# EAGLE design LightSwitch3 (EAGLE 8.7.0)
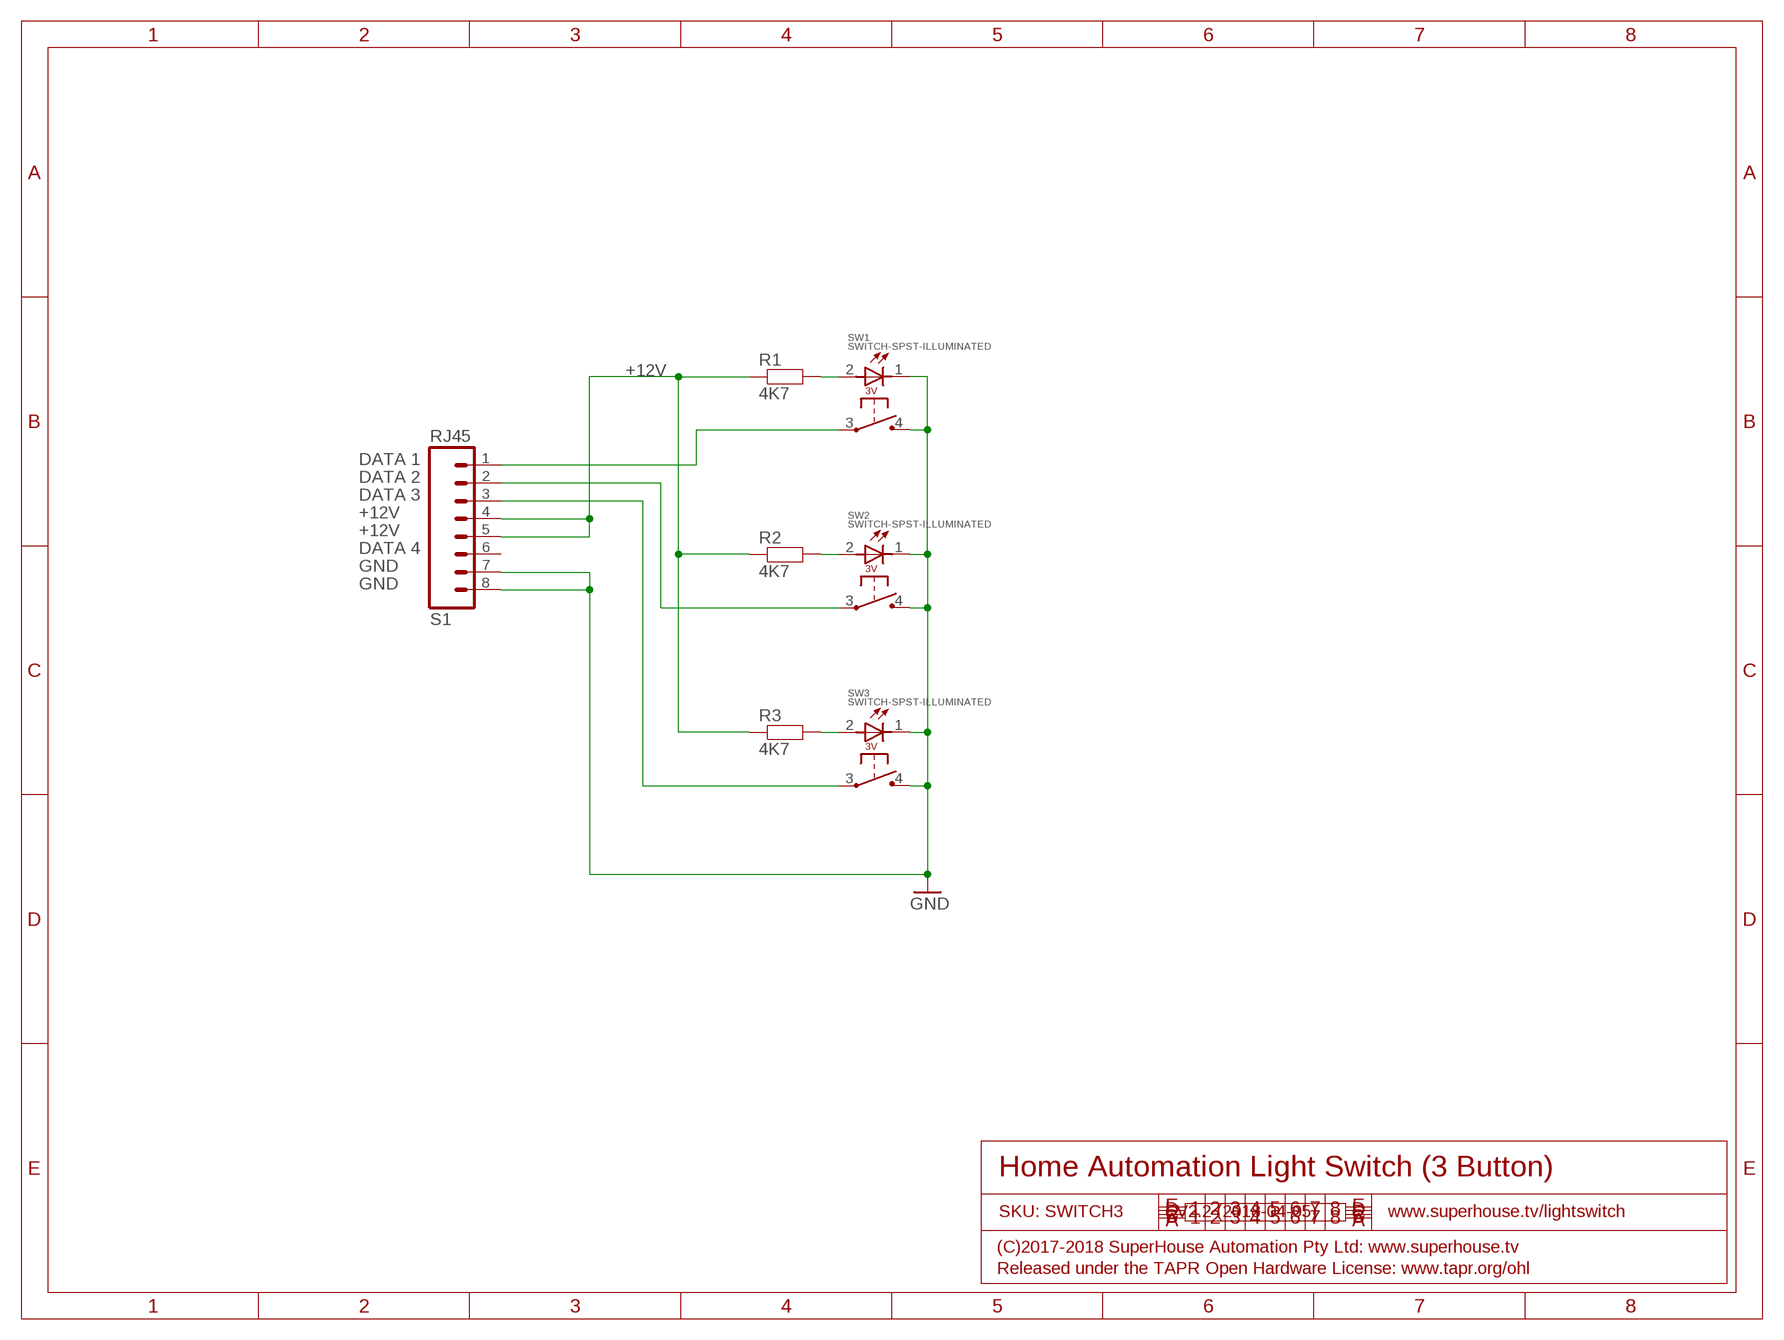
[diagram p0: schematic, sheet 1]

## Parts
R1  4K7  RESISTOR0603  [0603]
R2  4K7  RESISTOR0603  [0603]
R3  4K7  RESISTOR0603  [0603]
S1  RJ45  [RJ45]
SW1  SWITCH-SPST-ILLUMINATED  [SWITCH-SPST-ILLUMINATED]
SW2  SWITCH-SPST-ILLUMINATED  [SWITCH-SPST-ILLUMINATED]
SW3  SWITCH-SPST-ILLUMINATED  [SWITCH-SPST-ILLUMINATED]

## Nets
+12V: R1.1 R2.1 R3.1 S1.4 S1.5
GND: S1.7 S1.8 SW1.1(-) SW1.4(NO) SW2.1(-) SW2.4(NO) SW3.1(-) SW3.4(NO)
N$1: R1.2 SW1.2(+)
N$2: S1.3 SW3.3(COM)
N$3: R2.2 SW2.2(+)
N$4: S1.1 SW1.3(COM)
N$5: S1.2 SW2.3(COM)
N$6: R3.2 SW3.2(+)
Unconnected: S1.6

## Notes on the sheet
- DATA 1
- DATA 2
- DATA 3
- +12V
- +12V
- DATA 4
- GND
- GND
- Home Automation Light Switch (3 Button)
- SKU: SWITCH3 | V2.2 (2018-04-05) | www.superhouse.tv/lightswitch
- (C)2017-2018 SuperHouse Automation Pty Ltd: www.superhouse.tv
- Released under the TAPR Open Hardware License: www.tapr.org/ohl

## Library data of the parts
R1-R3 = freetronics-jon:RESISTOR: Resistor Basic schematic elements and footprints for 0603, 1206, and PTH 1/10th watt (small) resistors.
S1 = freetronics-jon:RJ45
SW1-SW3 = freetronics-jon:SWITCH-SPST-ILLUMINATED

## Net classes
0 Default: width 0.203 mm
1 VCC: width 0.305 mm

## Board
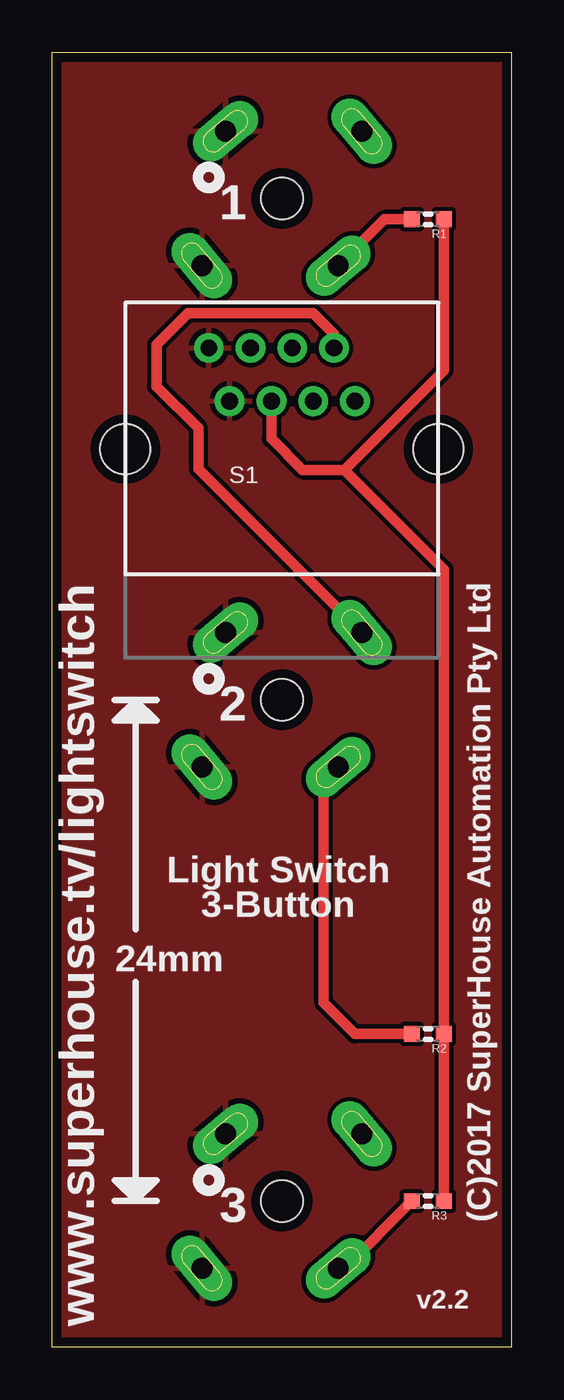
[diagram p1: board, top side]
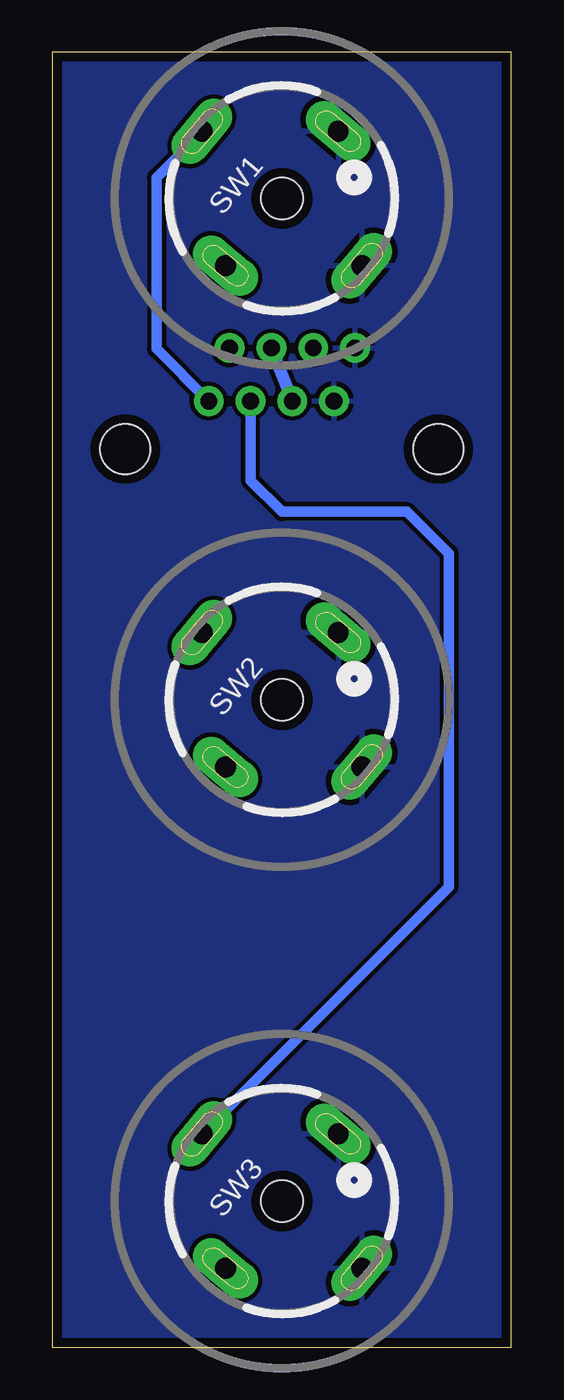
[diagram p2: board, bottom side, seen from below]

Size 22 x 62 mm. Coordinates in mm from the lower left corner, seen from the top.
Outline: 22,0 0,0 0,62 22,62 22,0
Copper layers (1*16): Top 0.035mm / dielectric 1.5mm / Bottom 0.035mm
Design rules "SuperHouse-Design-Rules": minimum track width 10mil, minimum drill 24mil, track to track 8mil, track to pad 8mil, pad to pad 8mil, via to via 8mil, smd to smd 6mil, copper to edge 18mil, drill to drill 8mil, minimum pad ring 7mil, minimum via ring 8mil, stop-mask expansion 4mil, vias tented up to drill 0.5mm, thermal gap 10mil
Holes 2 mm at 11,7 11,31 11,55

### Footprints (pad centres in the part's own frame; a part is rotated, then mirrored left to right if it is on the bottom)
0603 = smd 0.762 x 0.762: 1 -0.762,0; 2 0.762,0
RJ45 = drill 0.8 pad 1.422: 1 3.5,2.3; 2 2.5,4.84; 3 1.5,2.3; 4 0.5,4.84; 5 -0.5,2.3; 6 -1.5,4.84; 7 -2.5,2.3; 8 -3.5,4.84 | hole 2.4: -7.5,0; 7.5,0
SWITCH-SPST-ILLUMINATED = drill 1 pad 1.778 long: 1 4.2,0; 2 -4.2,0; 3 0,5; 4 0,-5

### Placement (x,y rotation side)
R1  18,54 180 top
R2  18,15 180 top
R3  18,7 180 top
S1  11,43 0 top
SW1  11,55 50 bottom
SW2  11,31 50 bottom
SW3  11,7 50 bottom

### Tracks (layer width: path | path; a pad name or v marks a point on that pad's centre or on a via)
+12V
  Top 0.508: S1.5 10.5,43.5 12,42 14,42 | R3.1 R2.1 18.76,37.24 14,42 | R1.1 18.76,46.76 14,42
  Bottom 0.61: S1.5 S1.4
GND
  pour Top: 22,62 0.04,62 0.04,0 22,0
  pour Bottom: 22,62 0.04,62 0.04,0 22,0
N$1
  Top 0.508: R1.2 15.92,54 SW1.2
N$2
  Bottom 0.508: S1.3 12.5,41.5 11,40 5,40 3,38 3,22.04 SW3.3
N$3
  Top 0.508: R2.2 14.5,15 13,16.5 13,27.08 SW2.2
N$4
  Bottom 0.508: SW1.3 14.83,58.17 17,56 17,47.8 S1.1
N$5
  Top 0.508: SW2.3 7,42.04 7,44 5,46 5,48 6.5,49.5 12.5,49.5 13.5,48.5 S1.2
N$6
  Top 0.508: R3.2 14.02,3.78 SW3.2

### Text on the board
tPlace: 1 | 2 | Light Switch / 3-Button | 24mm | 3 | (C)2017 SuperHouse Automation Pty Ltd | v2.2 | www.superhouse.tv/lightswitch